# Altium schematic sheet Boost_Conv_V1.0_Sensing_Sch.SchDoc
size A; SheetNumber: 3; SheetTotal: 3
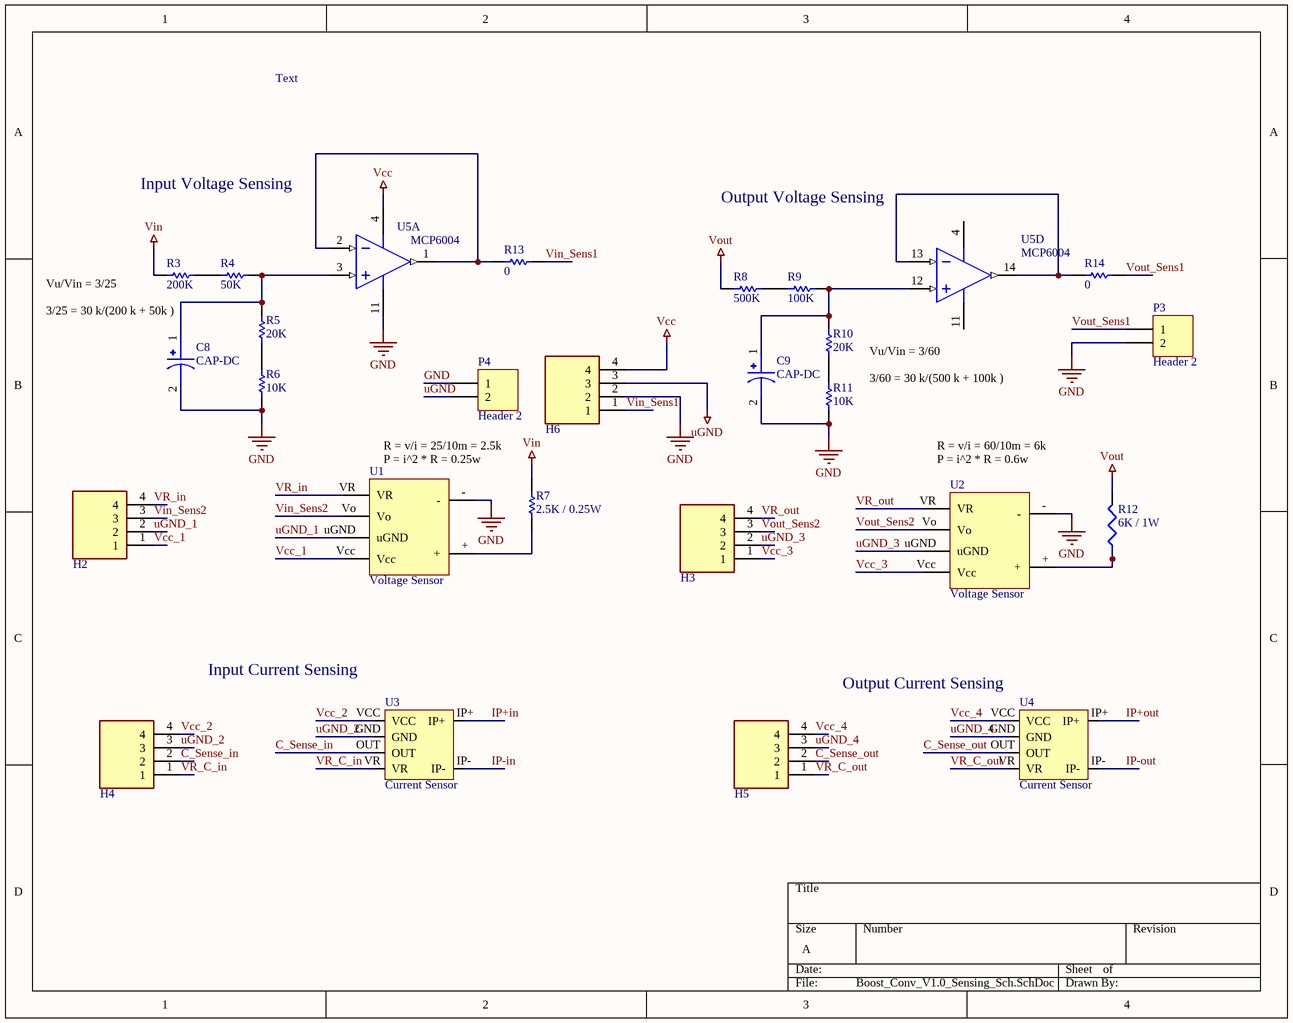
[diagram p0: Boost_Conv_V1.0_Sensing_Sch.SchDoc]

## Parts
C8  CAP-DC  [CAP-1.5]
C9  CAP-DC  [CAP-1.5]
H2  pin header 4p  [SIP4]  (value not drawn)
H3  pin header 4p  [SIP4]  (value not drawn)
H4  pin header 4p  [SIP4]  (value not drawn)
H5  pin header 4p  [SIP4]  (value not drawn)
H6  pin header 4p  [SIP4]  (value not drawn)
P3  Header 2  [HDR1X2]
P4  Header 2  [HDR1X2]
R3  value 200K  [AXIAL-0.3]  (hidden comment: Res1)
R4  value 50K  [AXIAL-0.3]  (hidden comment: Res1)
R5  value 20K  [AXIAL-0.3]  (hidden comment: Res1)
R6  value 10K  [AXIAL-0.3]  (hidden comment: Res1)
R7  2.5K / 0.25W  [R600]
R8  value 500K  [AXIAL-0.3]  (hidden comment: Res1)
R9  value 100K  [AXIAL-0.3]  (hidden comment: Res1)
R10  value 20K  [AXIAL-0.3]  (hidden comment: Res1)
R11  value 10K  [AXIAL-0.3]  (hidden comment: Res1)
R12  6K / 1W  [R-VSENSE]
R13  value 0  [AXIAL-0.3]  (hidden comment: Res1)
R14  value 0  [AXIAL-0.3]  (hidden comment: Res1)
U1  Voltage Sensor  [VSENSE]
U2  Voltage Sensor  [VSENSE]
U3  Current Sensor  [JCT-TSRNP]
U4  Current Sensor  [JCT-TSRNP]
U5  MCP6004  [DIP14]  (parts A,D of 4)

## Nets
GND: C8.2 C9.2 H6.2 P3.2 P4.1 R6.1 R11.1 U1.- U2.- U5.11(VEE)
uGND: H6.3 P4.2
Vcc: H6.4 U5.4(VCC)
Vin: R3.2 R7.2
Vout: R8.2 R12.2
C_Sense_in: H4.2 U3.OUT
C_Sense_out: H5.2 U4.OUT
IP+in: U3.IP+
IP+out: U4.IP+
IP-in: U3.IP-
IP-out: U4.IP-
uGND_1: H2.2 U1.uGND
uGND_2: H4.3 U3.GND
uGND_3: H3.2 U2.uGND
uGND_4: H5.3 U4.GND
Vcc_1: H2.1 U1.Vcc
Vcc_2: H4.4 U3.VCC
Vcc_3: H3.1 U2.Vcc
Vcc_4: H5.4 U4.VCC
Vin_Sens1: H6.1 R13.1
Vin_Sens2: H2.3 U1.Vo
Vout_Sens1: P3.1 R14.1
Vout_Sens2: H3.3 U2.Vo
VR_C_in: H4.1 U3.VR
VR_C_out: H5.1 U4.VR
VR_in: H2.4 U1.VR
VR_out: H3.4 U2.VR
NetC8_1: C8.1 R4.1 R5.2 U5.3(1_IN+)
NetC9_1: C9.1 R9.1 R10.2 U5.12(4_IN+)
NetR3_1: R3.1 R4.2
NetR5_1: R5.1 R6.2
NetR7_1: R7.1 U1.+
NetR8_1: R8.1 R9.2
NetR10_1: R10.1 R11.2
NetR12_1: R12.1 U2.+
NetR13_2: R13.2 U5.1(1_OUT) U5.2(1_IN-)
NetR14_2: R14.2 U5.13(4_IN-) U5.14(4_OUT)

## Notes on the sheet
- Text
- Input Voltage Sensing
- (near U5) Output Voltage Sensing
- (near R3) Vu/Vin = 3/25
  3/25 = 30 k/(200 k + 50k )
- Vu/Vin = 3/60
  3/60 = 30 k/(500 k + 100k )
- R = v/i = 25/10m = 2.5k
  P = i^2 * R = 0.25w
- R = v/i = 60/10m = 6k
  P = i^2 * R = 0.6w
- (near U3) Input Current Sensing
- (near U4) Output Current Sensing

## Library data of the parts
H2-H6 = pin header 4p: Manufacturer: TE Connectivity AMP; Manufacturer Part Number: 2355186-4; Supplier 1: Digi-Key; Supplier Part Number 1: 17-2355186-4-ND; Stock 1: 5950; Pricing 1: 1=0.84, 10=0.708, 100=0.6356, 500=0.52, 1000=0.46222, 5000=0.40444, 10000=0.38518 (USD)
P3 P4 = Header 2: Header, 2-Pin; LatestRevisionDate: 17-Jul-2002; LatestRevisionNote: Re-released for DXP Platform.; Publisher: Altium Limited
R3-R6 R8-R11 R13 R14 = Res1: Resistor; Published: 8-Jun-2000; LatestRevisionDate: 17-Jul-2002; LatestRevisionNote: Re-released for DXP Platform.; PackageReference: AXIAL-0.3; Publisher: Altium Limited; PackageDescription: Axial Device, Thru-Hole; 2 Leads; 0.3 in Pin Spacing
R7 = Res1: Resistor; SMD/TH: SMD
R12 = R-VSENSE
U1 U2 = Vsense-JCT-L25P3.3: JCT-L25P3.3-voltage sensor; Value: JCT-L25P3.3
U3 U4 = JCT-TSRNP: JCT-TSRNP3.3; Value: JCT-TSRNP3.3
U5 = MCP6004: Low Power Quad Operational Amplifier; note: SC; SMD/TH: SMD